# Altium schematic sheet [06] - FUSES.SchDoc: FUSES
size 433 x 279 mm; Author: ZAG; DrawnBy: ZAG; DocumentNumber: 5; SheetNumber: 6; SheetTotal: 8; PageSetup: Record=PageOptions|CenterHorizontal=True|CenterVertical=True|PrintScale=0.96|XCorrection=1.00|YCorrection=1.00|PrintKind=2|BorderSize=5000000|LeftOffset=0|BottomOffset=0|Orientation=2|PaperLength=4318|PaperWidth=2794|Scale=100|PaperSource=15|PrintQuality=600|MediaType=1|DitherType=10|PaperKind=11x17|PrintScaleMode=1; PCBRevision: 01; SchRevision: 01; Project: VAN BATT CTRLR V1; SchStatus: PRELIM
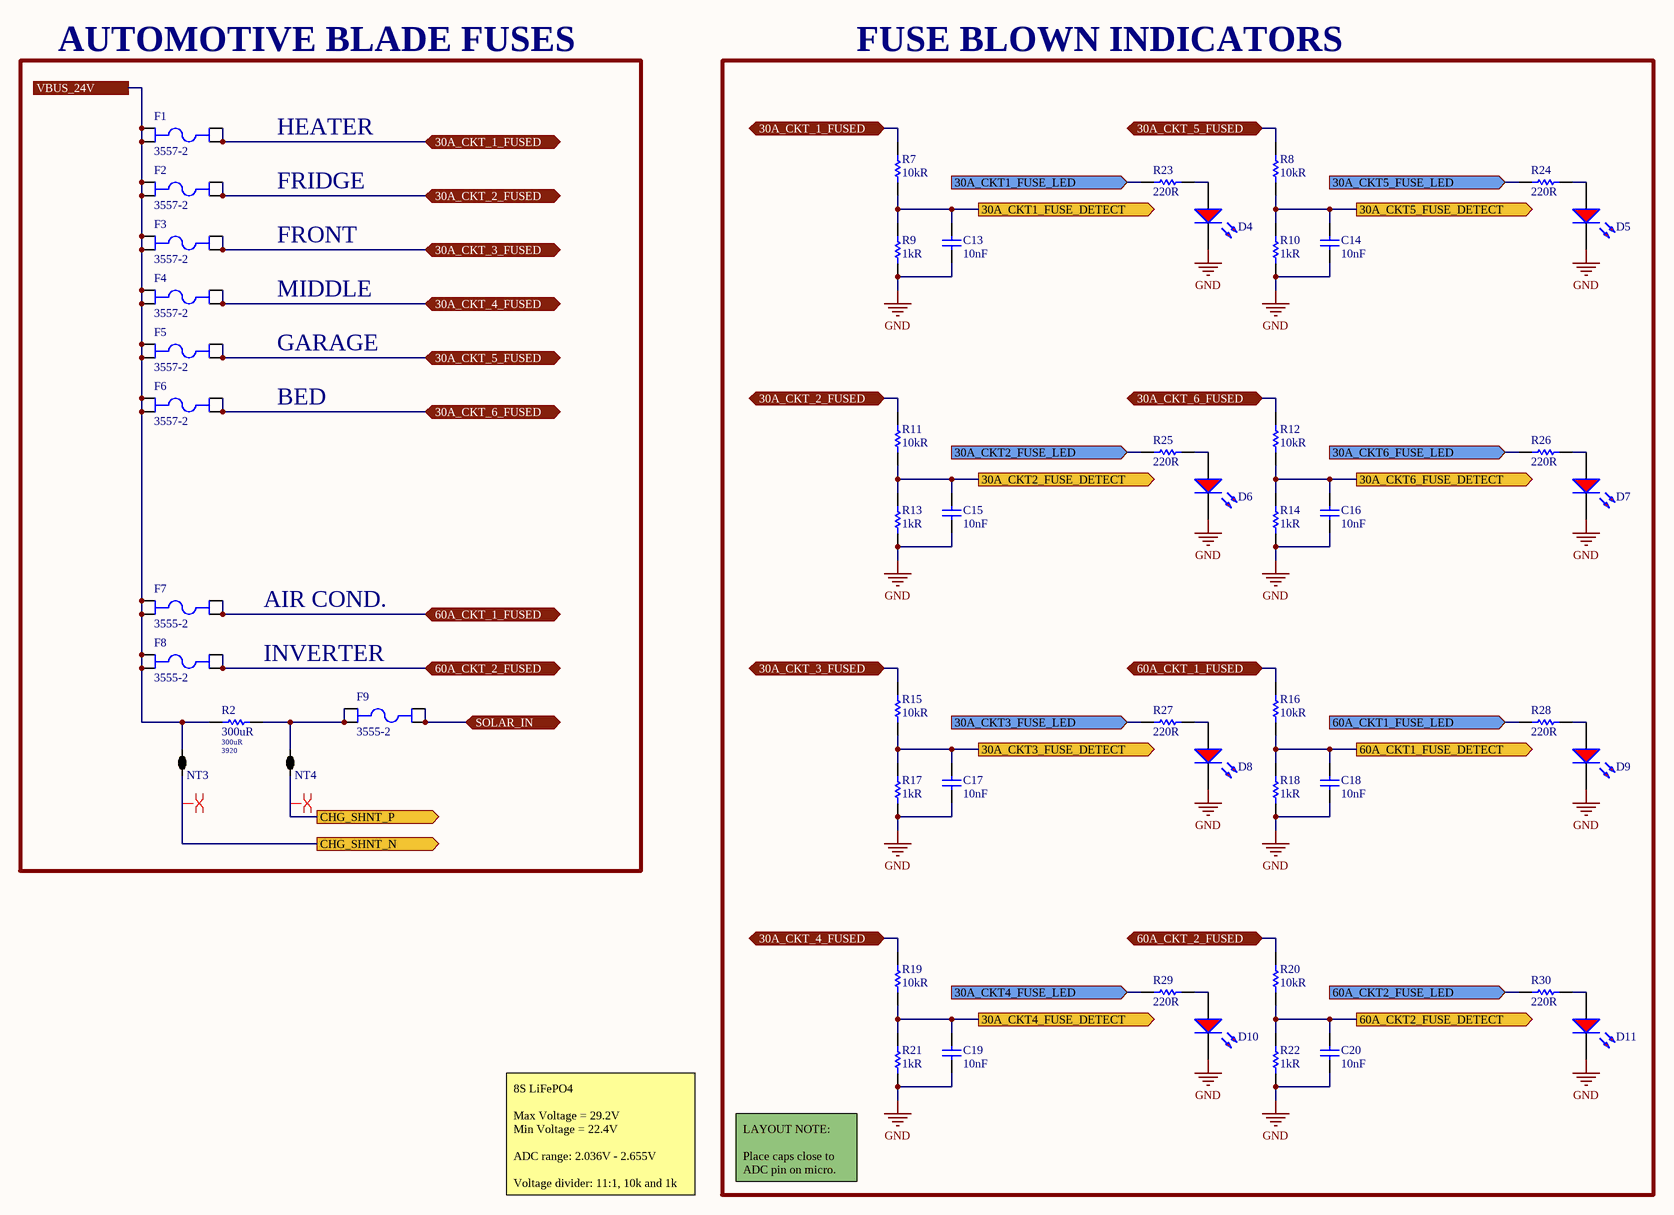
[diagram p0: [06] - FUSES.SchDoc]

## Parts
C13  10nF  [INCH 0603 - METRIC 1608 - H087]
C14  10nF  [INCH 0603 - METRIC 1608 - H087]
C15  10nF  [INCH 0603 - METRIC 1608 - H087]
C16  10nF  [INCH 0603 - METRIC 1608 - H087]
C17  10nF  [INCH 0603 - METRIC 1608 - H087]
C18  10nF  [INCH 0603 - METRIC 1608 - H087]
C19  10nF  [INCH 0603 - METRIC 1608 - H087]
C20  10nF  [INCH 0603 - METRIC 1608 - H087]
D4  Red  [LED - 1206 - RED]  (value not drawn)
D5  Red  [LED - 1206 - RED]  (value not drawn)
D6  Red  [LED - 1206 - RED]  (value not drawn)
D7  Red  [LED - 1206 - RED]  (value not drawn)
D8  Red  [LED - 1206 - RED]  (value not drawn)
D9  Red  [LED - 1206 - RED]  (value not drawn)
D10  Red  [LED - 1206 - RED]  (value not drawn)
D11  Red  [LED - 1206 - RED]  (value not drawn)
F1  3557-2  [KEYSTONE_3557-2]
F2  3557-2  [KEYSTONE_3557-2]
F3  3557-2  [KEYSTONE_3557-2]
F4  3557-2  [KEYSTONE_3557-2]
F5  3557-2  [KEYSTONE_3557-2]
F6  3557-2  [KEYSTONE_3557-2]
F7  3555-2  [KEYSTONE_3555-2]
F8  3555-2  [KEYSTONE_3555-2]
F9  3555-2  [KEYSTONE_3555-2]
NT3  2 way net tie junction  [2way_LP]  (value not drawn)  (net tie, no BOM)
NT4  2 way net tie junction  [2way_LP]  (value not drawn)  (net tie, no BOM)
R2  300uR  Package: 3920  [VISHAY_3920]
R7  10kR  [INCH 0603 - METRIC 1508 - H050]
R8  10kR  [INCH 0603 - METRIC 1508 - H050]
R9  1kR  [INCH 0603 - METRIC 1508 - H050]
R10  1kR  [INCH 0603 - METRIC 1508 - H050]
R11  10kR  [INCH 0603 - METRIC 1508 - H050]
R12  10kR  [INCH 0603 - METRIC 1508 - H050]
R13  1kR  [INCH 0603 - METRIC 1508 - H050]
R14  1kR  [INCH 0603 - METRIC 1508 - H050]
R15  10kR  [INCH 0603 - METRIC 1508 - H050]
R16  10kR  [INCH 0603 - METRIC 1508 - H050]
R17  1kR  [INCH 0603 - METRIC 1508 - H050]
R18  1kR  [INCH 0603 - METRIC 1508 - H050]
R19  10kR  [INCH 0603 - METRIC 1508 - H050]
R20  10kR  [INCH 0603 - METRIC 1508 - H050]
R21  1kR  [INCH 0603 - METRIC 1508 - H050]
R22  1kR  [INCH 0603 - METRIC 1508 - H050]
R23  220R  [INCH 0603 - METRIC 1608 - H055]
R24  220R  [INCH 0603 - METRIC 1608 - H055]
R25  220R  [INCH 0603 - METRIC 1608 - H055]
R26  220R  [INCH 0603 - METRIC 1608 - H055]
R27  220R  [INCH 0603 - METRIC 1608 - H055]
R28  220R  [INCH 0603 - METRIC 1608 - H055]
R29  220R  [INCH 0603 - METRIC 1608 - H055]
R30  220R  [INCH 0603 - METRIC 1608 - H055]

## Blocks framed on the sheet
AUTOMOTIVE BLADE FUSES: F1-F9 NT3 NT4 R2
FUSE BLOWN INDICATORS: C13-C20 D4-D11 R7-R30

## Ports
30A_CKT1_FUSE_DETECT (out), 30A_CKT1_FUSE_LED (in), 30A_CKT2_FUSE_DETECT (out), 30A_CKT2_FUSE_LED (in), 30A_CKT3_FUSE_DETECT (out), 30A_CKT3_FUSE_LED (in), 30A_CKT4_FUSE_DETECT (out), 30A_CKT4_FUSE_LED (in), 30A_CKT5_FUSE_DETECT (out), 30A_CKT5_FUSE_LED (in), 30A_CKT6_FUSE_DETECT (out), 30A_CKT6_FUSE_LED (in), 30A_CKT_1_FUSED (bidir), 30A_CKT_2_FUSED (bidir), 30A_CKT_3_FUSED (bidir), 30A_CKT_4_FUSED (bidir), 30A_CKT_5_FUSED (bidir), 30A_CKT_6_FUSED (bidir), 60A_CKT1_FUSE_DETECT (out), 60A_CKT1_FUSE_LED (in), 60A_CKT2_FUSE_DETECT (out), 60A_CKT2_FUSE_LED (in), 60A_CKT_1_FUSED (bidir), 60A_CKT_2_FUSED (bidir), CHG_SHNT_N (out), CHG_SHNT_P (out), SOLAR_IN (bidir), VBUS_24V

## Nets
GND: C13.1 C14.1 C15.1 C16.1 C17.1 C18.1 C19.1 C20.1 D4.C D5.C D6.C D7.C D8.C D9.C D10.C D11.C R9.1 R10.1 R13.1 R14.1 R17.1 R18.1 R21.1 R22.1
30A_CKT1_FUSE_DETECT: C13.2 R7.1 R9.2 ; port 30A_CKT1_FUSE_DETECT
30A_CKT1_FUSE_LED: R23.1 ; port 30A_CKT1_FUSE_LED
30A_CKT2_FUSE_DETECT: C15.2 R11.1 R13.2 ; port 30A_CKT2_FUSE_DETECT
30A_CKT2_FUSE_LED: R25.1 ; port 30A_CKT2_FUSE_LED
30A_CKT3_FUSE_DETECT: C17.2 R15.1 R17.2 ; port 30A_CKT3_FUSE_DETECT
30A_CKT3_FUSE_LED: R27.1 ; port 30A_CKT3_FUSE_LED
30A_CKT4_FUSE_DETECT: C19.2 R19.1 R21.2 ; port 30A_CKT4_FUSE_DETECT
30A_CKT4_FUSE_LED: R29.1 ; port 30A_CKT4_FUSE_LED
30A_CKT5_FUSE_DETECT: C14.2 R8.1 R10.2 ; port 30A_CKT5_FUSE_DETECT
30A_CKT5_FUSE_LED: R24.1 ; port 30A_CKT5_FUSE_LED
30A_CKT6_FUSE_DETECT: C16.2 R12.1 R14.2 ; port 30A_CKT6_FUSE_DETECT
30A_CKT6_FUSE_LED: R26.1 ; port 30A_CKT6_FUSE_LED
30A_CKT_1_FUSED: F1.3 F1.4 R7.2 ; port 30A_CKT_1_FUSED
30A_CKT_2_FUSED: F2.3 F2.4 R11.2 ; port 30A_CKT_2_FUSED
30A_CKT_3_FUSED: F3.3 F3.4 R15.2 ; port 30A_CKT_3_FUSED
30A_CKT_4_FUSED: F4.3 F4.4 R19.2 ; port 30A_CKT_4_FUSED
30A_CKT_5_FUSED: F5.3 F5.4 R8.2 ; port 30A_CKT_5_FUSED
30A_CKT_6_FUSED: F6.3 F6.4 R12.2 ; port 30A_CKT_6_FUSED
60A_CKT1_FUSE_DETECT: C18.2 R16.1 R18.2 ; port 60A_CKT1_FUSE_DETECT
60A_CKT1_FUSE_LED: R28.1 ; port 60A_CKT1_FUSE_LED
60A_CKT2_FUSE_DETECT: C20.2 R20.1 R22.2 ; port 60A_CKT2_FUSE_DETECT
60A_CKT2_FUSE_LED: R30.1 ; port 60A_CKT2_FUSE_LED
60A_CKT_1_FUSED: F7.3 F7.4 R16.2 ; port 60A_CKT_1_FUSED
60A_CKT_2_FUSED: F8.3 F8.4 R20.2 ; port 60A_CKT_2_FUSED
CHG_SHNT_N: NT3.1 ; port CHG_SHNT_N
CHG_SHNT_P: NT4.1 ; port CHG_SHNT_P
SOLAR_IN: F9.3 F9.4 ; port SOLAR_IN
VBUS_24V: F1.1 F1.2 F2.1 F2.2 F3.1 F3.2 F4.1 F4.2 F5.1 F5.2 F6.1 F6.2 F7.1 F7.2 F8.1 F8.2 NT3.2 R2.1 ; port VBUS_24V
NetD4_A: D4.A R23.2
NetD5_A: D5.A R24.2
NetD6_A: D6.A R25.2
NetD7_A: D7.A R26.2
NetD8_A: D8.A R27.2
NetD9_A: D9.A R28.2
NetD10_A: D10.A R29.2
NetD11_A: D11.A R30.2
NetF9_1: F9.1 F9.2 NT4.2 R2.2

## Layout directives
differential pair: CHG_SHNT_N, CHG_SHNT_P

## Notes on the sheet
- HEATER
- FRIDGE
- FRONT
- MIDDLE
- GARAGE
- BED
- AIR COND.
- INVERTER
- 8S LiFePO4
  Max Voltage = 29.2V
  Min Voltage = 22.4V
  ADC range: 2.036V - 2.655V
  Voltage divider: 11:1, 10k and 1k
- LAYOUT NOTE:
  Place caps close to ADC pin on micro.
- SHEET TITLE
- SCH REV:
- PROJECT NAME
- PCB REV:
- DATE:
- DRAWN BY
- CONTACT
- MANUFACTURER, OR SALE OF PROCESSES OR PRODUCTS WITHOUT THE EXPRESSED WRITTEN CONSENT OF
- THE INFORMATION CONTAINED HEREIN IS DEEMED TO BE CONFIDENTIAL, PROPRIETARY, AND A TRADE SECRET OF
- THIS INFORMATION MAY NOT BE USED, REPRODUCED, OR DISCLOSED AS THE DIRECT OR INDIRECT BASIS FOR THE DEVELOPMENT,
- SHEET
- www.mule-labs.com <http://www.mule-labs.com>
- OF
- SIZE: B
- DO NOT SCALE DRAWING

## Library data of the parts
C13-C20 = C0603C103K4RECAUTO: CAP CER 0603 10NF 16V X7R 10%; Manufacturer: KEMET; Supplier 1: Digi-Key; Manufacturer Part Number: C0603C103K4RECAUTO; RoHS: No; Stock 1: 8030; Pricing 1: 1=0.17000, 10=0.12100, 100=0.05670, 500=0.03978, 1000=0.03293 (USD); Mount: Surface Mount; Case/Package: 0603; Case Code (Imperial): 0603; Case Code (Metric): 1608; Min Operating Temperature: -55°C; Max Operating Temperature: 125°C; Packaging: Tape and Reel; Capacitance: 10nF; Tolerance: 10%; Voltage Rating: 16V; Ratings: AEC-Q200; ComponentLink1URL: https://api.kemet.com/component-edge/download/datasheet/C0603C103K4RECAUTO.pdf?src-supplier=Digi-Key; ComponentLink1Description: https://api.kemet.com/component-edge/download/datasheet/C0603C103K4RECAUTO.pdf?src-supplier=Digi-Key; Supplier Part Number 1: 399-17880-1-ND
D4-D11 = APT3216LSECK/J3-PRV: LED RED CLEAR 2SMD; Manufacturer 1: Kingbright; Lens Color: Colorless; Luminous Intensity: 40mcd; Test Current: 2mA; Viewing Angle: 120°; Dominant Wavelength: 625nm; Forward Voltage: 1.8V; Manufacturer Part Number 1: APT3216LSECK/J3-PRV; RoHS: Yes; Category: LEDs; Stock 1: 1142; Pricing 1: 1=0.51000, 10=0.40100, 100=0.25730, 500=0.22124, 1000=0.17081 (USD); Mount: Surface Mount; Case/Package: 1206; Color: Red; Case Code (Metric): 3216; Case Code (Imperial): 1206; Packaging: Tape and Reel; Lens Transparency: Clear; Length: 3.2mm; Height: 0.75mm; Width: 1.6mm; ComponentLink1URL: http://www.mouser.com/ds/2/216/APT3216LSECK-J3-PRV-535779.pdf?src-supplier=Mouser; ComponentLink1Description: http://www.mouser.com/ds/2/216/APT3216LSECK-J3-PRV-535779.pdf?src-supplier=Mouser; ComponentLink2URL: http://www.kingbrightusa.com/images/catalog/SPEC/APT3216LSECK-J3-PRV.pdf?src-supplier=Digi-Key; ComponentLink2Description: http://www.kingbrightusa.com/images/catalog/SPEC/APT3216LSECK-J3-PRV.pdf?src-supplier=Digi-Key; Supplier 1: Digi-Key; Manufacturer Part Number: APT3216LSECK/J3-PRV; Supplier Part Number 1: 754-1940-1-ND
F1-F6 = 3557-2: Fuse Holder; Auto; 2 in1 Blade; THM; 1 Fuse; Vertical; 30 Amps; Manufacturer: Keystone Electronics; Color: Black; Material: Brass,Tin,Nylon; Current Rating: 20A; Voltage Rating (AC): 500V; Number of Poles: 1; Illumination Type: Illuminated; Fuse Type: Automotive; Fuse Size: ATO, ATC, or Mini ATO, ATC; Supplier 1: Digi-Key; Manufacturer Part Number: 3557-2; RoHS: Yes; Category: Fuses; Pricing 1: 1=1.22000, 25=1.01080, 100=0.92640, 250=0.84220, 500=0.75798, 1000=0.67376, 2500=0.61060, 5000=0.58954 (USD); Mount: Vertical,PCB; Contact Plating: Tin; Contact Material: Brass; Min Operating Temperature: -50°C; Max Operating Temperature: 145°C; Package Quantity: 1; Number of Circuits: 1; Termination: PC Pin; Voltage: 500V; Fuse Current: 20A; Orientation: Vertical; Series: -; Length: 19.8mm; Depth: 6.8mm; Size: 0.265inch; REACH SVHC: No SVHC; Lead Free: Lead Free; Flammability Rating: UL94 V-0; ComponentLink1URL: https://datasheet.ciiva.com/22650/1686040-22650698.pdf?src-supplier=Element14; ComponentLink1Description: https://datasheet.ciiva.com/22650/1686040-22650698.pdf?src-supplier=Element14; ComponentLink2URL: https://datasheet.ciiva.com/16369/m60-2p39-16369546.pdf?src-supplier=Future+Electronics; ComponentLink2Description: https://datasheet.ciiva.com/16369/m60-2p39-16369546.pdf?src-supplier=Future+Electronics; Supplier Part Number 1: 36-3557-2-ND
F7-F9 = 3555-2: Fuse Block Cartridge Holder; Manufacturer: Keystone Electronics; Color: Black; Material: Copper,Brass,Tin,Nylon; Body Material: Nylon,Glass; Current Rating: 40A; Voltage Rating (AC): 500V; Number of Poles: 1; Illumination Type: Illuminated; Fuse Type: Automotive; Fuse Size: MAXI™; Approvals: UL; Supplier 1: Digi-Key; Manufacturer Part Number: 3555-2; RoHS: Yes; Category: Fuse Holders; Stock 1: 46563; Pricing 1: 1=1.94000, 25=1.64920, 100=1.50590, 250=1.36248, 500=1.25492, 1000=1.07565, 2500=1.00394, 5000=0.95374 (USD); Mount: Vertical,PCB; Contact Material: Copper,Tin; Contact Plating: Nickel; Min Operating Temperature: -50°C; Max Operating Temperature: 145°C; Package Quantity: 100; Number of Circuits: 1; Termination: PC Pin; Voltage: 500V; Fuse Current: 40A; Orientation: Vertical; Series: -; Length: 35.8mm; Depth: 5.9mm; Lead Free: Lead Free; REACH SVHC: No SVHC; ComponentLink1URL: https://datasheet.ciiva.com/16365/m60-2p38-16365263.pdf?src-supplier=Future+Electronics; ComponentLink1Description: https://datasheet.ciiva.com/16365/m60-2p38-16365263.pdf?src-supplier=Future+Electronics; Supplier Part Number 1: 36-3555-2-ND
NT3 NT4 = 2way: ComponentLink1URL: http://www.edatools.cz/addons; ComponentLink1Description: Source; FootprintNote: LP=12mil, MP=40mil, HP=120mil
R2 = Y14840R00030F9R: CSM3920A 0R0030 1.0% S T 130800 Chip Resistor Strip 3920 (1052 Metric); Manufacturer: Vishay Precision Group; Supplier 1: Digi-Key; Manufacturer Part Number: Y14840R00030F9R; RoHS: No; Category: Chip SMD Resistors; Stock 1: 5999; Pricing 1: 1=1.970000, 10=1.750000, 25=1.622400, 50=1.527200, 100=1.336200, 250=1.145360, 500=0.954440, 1000=0.827190 (USD); Supplier Part Number 1: 804-Y14840R00030F9RCT-ND; Resistance: 300uR
R7 R8 R11 R12 R15 R16 R19 R20 = RR0816P-103-D: RES SMD 10K OHM 0.5% 1/16W 0603; Manufacturer: Susumu; Power Rating: 63mW; Voltage Rating: 75V; Temperature Coefficient: 25ppm/°C; Supplier 1: Digi-Key; Manufacturer Part Number: RR0816P-103-D; Stock 1: 1106095; Pricing 1: 1=0.11, 10=0.098, 100=0.0376, 1000=0.01654, 2500=0.01428 (USD); Case/Package: 0603; Number of Pins: 2; Weight: 7.1E-05oz; Case Code (Imperial): 0603; Case Code (Metric): 1608; Min Operating Temperature: -55°C; Max Operating Temperature: 125°C; Packaging: Tape and Reel; Resistance: 10kR; Tolerance: 0.5%; Package Quantity: 1; Termination: SMD/SMT; Composition: Thin Film; Number of Terminations: 2; Max Power Dissipation: 63mW; Voltage Rating (DC): 75V; Length: 1.6mm; Height: 0.4mm; Width: 0.8mm; Depth: 0.8mm; REACH SVHC: Unknown; Lead Free: Lead Free; ComponentLink1URL: https://datasheet.ciiva.com/11820/0900766b80808d64-11820656.pdf; ComponentLink1Description: https://datasheet.ciiva.com/11820/0900766b80808d64-11820656.pdf; ComponentLink2URL: https://datasheet.ciiva.com/2487/rr-data-sheet-2487034.pdf; ComponentLink2Description: https://datasheet.ciiva.com/2487/rr-data-sheet-2487034.pdf; ComponentLink3URL: https://datasheet.ciiva.com/2487/rr-data-sheet-2487035.pdf; ComponentLink3Description: https://datasheet.ciiva.com/2487/rr-data-sheet-2487035.pdf; ComponentLink4URL: https://datasheet.ciiva.com/2487/rr-data-sheet-2487036.pdf; ComponentLink4Description: https://datasheet.ciiva.com/2487/rr-data-sheet-2487036.pdf; Supplier Part Number 1: RR08P10.0KDCT-ND; Category: Resistor
R9 R10 R13 R14 R17 R18 R21 R22 = CRCW06031K00FKEA: RES SMD 1K OHM 1% 1/10W 0603; Manufacturer: Vishay Dale; Temperature Coefficient: 100ppm/°C; Power Rating: 100mW; Voltage Rating: 75V; Supplier 1: Digi-Key; Manufacturer Part Number: CRCW06031K00FKEA; RoHS: Yes; Category: Chip SMD Resistors; Stock 1: 445458; Pricing 1: 1=0.10000, 10=0.03400, 100=0.01390, 1000=0.00624, 2500=0.00542 (USD); Mount: Surface Mount; Case/Package: 0603; Number of Pins: 2; Contact Plating: Tin; Weight: 7.1E-05oz; Case Code (Metric): 1608; Case Code (Imperial): 0603; Size Code: 0603; Min Operating Temperature: -55°C; Max Operating Temperature: 155°C; Resistor Type: Thick Film; Resistance: 1kR; Tolerance: 1%; Termination: SMD/SMT; Packaging: Tape and Reel; Package Quantity: 10; Number of Terminations: 2; Max Power Dissipation: 100mW; Voltage Rating (DC): 75V; Features: Automotive AEC-Q200; Series: CRCW; Technology: THICK FILM; Construction: Rectangular; Resistance Tolerance: 1%; Length: 1.55mm; Width: 0.033inch; Height: 0.45mm; Depth: 0.85mm; Radiation Hardening: No; Lead Free: Lead Free; RoHS Compliant: Yes; REACH SVHC: Unknown; Military Standard: Not; ComponentLink1URL: https://datasheet.ciiva.com/11808/0900766b80d98afc-11808625.pdf?src-supplier=RSComponents; ComponentLink1Description: https://datasheet.ciiva.com/11808/0900766b80d98afc-11808625.pdf?src-supplier=RSComponents; ComponentLink2URL: https://datasheet.ciiva.com/8336/dcrcwe3-8336822.pdf?src-supplier=Avnet; ComponentLink2Description: https://datasheet.ciiva.com/8336/dcrcwe3-8336822.pdf?src-supplier=Avnet; ComponentLink3URL: https://datasheet.ciiva.com/16515/dcrcwe3-16515078.pdf?src-supplier=Avnet+Asia; ComponentLink3Description: https://datasheet.ciiva.com/16515/dcrcwe3-16515078.pdf?src-supplier=Avnet+Asia; ComponentLink4URL: https://datasheet.ciiva.com/3257/dcrcwe3-3257132.pdf?src-supplier=Avnet; ComponentLink4Description: https://datasheet.ciiva.com/3257/dcrcwe3-3257132.pdf?src-supplier=Avnet; ComponentLink5URL: https://datasheet.ciiva.com/2465/dcrcwe3-2465534.pdf?src-supplier=Digi-Key; ComponentLink5Description: https://datasheet.ciiva.com/2465/dcrcwe3-2465534.pdf?src-supplier=Digi-Key; ComponentLink6URL: https://datasheet.ciiva.com/16893/dcrcwe3-16893742.pdf?src-supplier=Avnet+Europe; ComponentLink6Description: https://datasheet.ciiva.com/16893/dcrcwe3-16893742.pdf?src-supplier=Avnet+Europe; ComponentLink7URL: https://datasheet.ciiva.com/2465/dcrcwe3-2465535.pdf?src-supplier=Digi-Key; ComponentLink7Description: https://datasheet.ciiva.com/2465/dcrcwe3-2465535.pdf?src-supplier=Digi-Key; ComponentLink8URL: https://datasheet.ciiva.com/2465/dcrcwe3-2465536.pdf?src-supplier=Digi-Key; ComponentLink8Description: https://datasheet.ciiva.com/2465/dcrcwe3-2465536.pdf?src-supplier=Digi-Key; ComponentLink9URL: https://datasheet.ciiva.com/26316/fld-crcw-e3-data-en-26316551.pdf?src-supplier=Distrelec; ComponentLink9Description: https://datasheet.ciiva.com/26316/fld-crcw-e3-data-en-26316551.pdf?src-supplier=Distrelec; ComponentLink10URL: https://datasheet.ciiva.com/46441/1720486-46441623.pdf?src-supplier=Element14; ComponentLink10Description: https://datasheet.ciiva.com/46441/1720486-46441623.pdf?src-supplier=Element14; ComponentLink11URL: https://datasheet.ciiva.com/46441/1720486-46441622.pdf?src-supplier=Element14; ComponentLink11Description: https://datasheet.ciiva.com/46441/1720486-46441622.pdf?src-supplier=Element14; ComponentLink12URL: https://datasheet.ciiva.com/46385/1697337-46385497.pdf?src-supplier=Element14; ComponentLink12Description: https://datasheet.ciiva.com/46385/1697337-46385497.pdf?src-supplier=Element14; ComponentLink13URL: https://datasheet.ciiva.com/16199/dcrcwe3-16199053.pdf?src-supplier=Future+Electronics; ComponentLink13Description: https://datasheet.ciiva.com/16199/dcrcwe3-16199053.pdf?src-supplier=Future+Electronics; Supplier Part Number 1: 541-1.00KHCT-ND
R23-R30 = RC0603FR-07220RL: RES SMD 220 OHM 1% 1/10W 0603; Manufacturer: Yageo; Temperature Coefficient: 100ppm/°C; Voltage Rating (DC): 50V; Power Rating: 100mW; Supplier 1: Digi-Key; Manufacturer Part Number: RC0603FR-07220RL; Stock 1: 8341820; Case/Package: 0603; Number of Pins: 2; Case Code (Imperial): 0603; Case Code (Metric): 1608; Min Operating Temperature: -55°C; Max Operating Temperature: 155°C; Resistance: 220R; Tolerance: 1%; Packaging: Tape and Reel; Composition: Thick Film; Voltage Rating: 50V; Package Quantity: 1; Termination: SMD/SMT; Number of Terminations: 2; Military Standard: Not; Max Power Dissipation: 100mW; Features: Moisture Resistant; Length: 1.6mm; Height: 0.022inch; Width: 0.031inch; Depth: 0.8mm; REACH SVHC: No SVHC; Lead Free: Lead Free; ComponentLink1URL: http://www.yageo.com/documents/recent/PYu-RC_Group_51_RoHS_L_9.pdf; ComponentLink1Description: http://www.yageo.com/documents/recent/PYu-RC_Group_51_RoHS_L_9.pdf; ComponentLink2URL: http://documents.rs-components.com/techlib://itc_doclist_GB.htm?stockno=5050303; ComponentLink2Description: http://documents.rs-components.com/techlib://itc_doclist_GB.htm?stockno=5050303; ComponentLink3URL: http://www.farnell.com/datasheets/1738695.pdf; ComponentLink3Description: http://www.farnell.com/datasheets/1738695.pdf; Supplier Part Number 1: 311-220HRCT-ND